# EAGLE design tes1 (EAGLE 6.2)
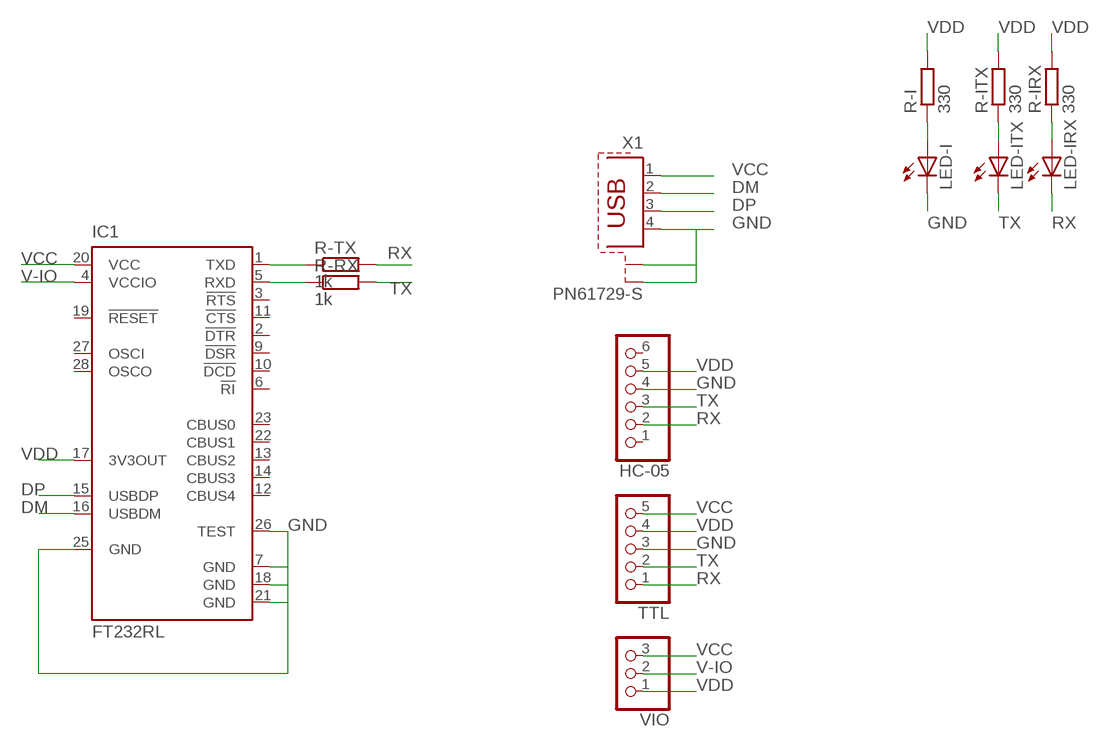
[diagram p0: schematic, sheet 1]

## Parts
HC-05  PINHD-1X6  [1X06]
IC1  FT232RL  [SSOP28]
LED-I  LED3MM  [LED3MM]
LED-IRX  LED3MM  [LED3MM]
LED-ITX  LED3MM  [LED3MM]
R-I  330  R-EU_0204/7  [0204/7]
R-IRX  330  R-EU_0204/7  [0204/7]
R-ITX  330  R-EU_0204/7  [0204/7]
R-RX  1k  R-EU_0204/7  [0204/7]
R-TX  1k  R-EU_0204/7  [0204/7]
TTL  PINHD-1X5  [1X05]
VIO  PINHD-1X3  [1X03]
X1  PN61729-S  [PN61729-S]

## Nets
DM: IC1.16(USBDM) X1.2
DP: IC1.15(USBDP) X1.3
GND: HC-05.4 IC1.7(GND) IC1.18(GND) IC1.21(GND) IC1.25(GND) IC1.26(TEST) LED-I.K(C) TTL.3 X1.4 X1.S1 X1.S2
N$1: LED-I.A R-I.1
N$2: LED-ITX.A R-ITX.1
N$4: LED-IRX.A R-IRX.1
N$10: IC1.5(RXD) R-RX.1
N$11: IC1.1(TXD) R-TX.1
RX: HC-05.2 LED-IRX.K(C) R-TX.2 TTL.1
TX: HC-05.3 LED-ITX.K(C) R-RX.2 TTL.2
V-IO: IC1.4(VCCIO) VIO.2
VCC: IC1.20(VCC) TTL.5 VIO.3 X1.1
VDD: HC-05.5 IC1.17(3V3OUT) R-I.2 R-IRX.2 R-ITX.2 TTL.4 VIO.1
Unconnected: HC-05.1 HC-05.6 IC1.2(!DTR) IC1.3(!RTS) IC1.6(!RI) IC1.9(!DSR) IC1.10(!DCD) IC1.11(!CTS) IC1.12(CBUS4) IC1.13(CBUS2) IC1.14(CBUS3) IC1.19(!RESET) IC1.22(CBUS1) IC1.23(CBUS0) IC1.27(OSCI) IC1.28(OSCO)

## Library data of the parts
HC-05 = pinhead:PINHD-1X6: PIN HEADER
IC1 = ftdichip:FT232R: Source: http://www.ftdichip.com/Documents/DataSheets/DS_FT232R_v104.pdf; MPN: FT232RL; OC_FARNELL: 1146032; OC_NEWARK: 91K9918
LED-I LED-IRX LED-ITX = led:LED: LED OSRAM: - CHIPLED LG R971, LG N971, LY N971, LG Q971, LY Q971, LO R971, LY R971 LH N974, LH R974 LS Q976, LO Q976, LY Q976 LO Q996 - Hyper CHIPLED LW Q18S LB Q993, LB Q99A, LB R99A - SideLED LS A670, LO A670, LY A670, LG A670, LP A670 LB A673, LV A673, LT A673, LW A673 LH A674 LY A675 LS A676, LA A676, LO A676, LY A676, LW A676 LS A679, LY A679, LG A679 - Hyper Micro SIDELED® LS Y876, LA Y876, LO Y876, LY Y876 LT Y87S - SmartLED LW L88C, LW L88S LB L89C, LB L89S, LG L890 LS L89K, LO L89K, LY L89K LS L896, LA L896, LO L896, LY L896 - TOPLED LS T670, LO T670, LY T670, LG T670, LP T670 LSG T670, LSP T670, LSY T670, LOP T670, LYG T670 LG T671, LOG T671, LSG T671 LB T673, LV T673, LT T673, LW T673 LH T674 LS T676, LA T676, LO T676, LY T676, LB T676, LH T676, LSB T676, LW T676 LB T67C, LV T67C, LT T67C, LS T67K, LO T67K, LY T67K, LW E67C LS E67B, LA E67B, LO E67B, LY E67B, LB E67C, LV E67C, LT E67C LW T67C LS T679, LY T679, LG T679 LS T770, LO T770, LY T770, LG T770, LP T770 LB T773, LV T773, LT T773, LW T773 LH T774 LS E675, LA E675, LY E675, LS T675 LS T776, LA T776, LO T776, LY T776, LB T776 LHGB T686 LT T68C, LB T68C - Hyper Mini TOPLED® LB M676 - Mini TOPLED Santana® LG M470 LS M47K, LO M47K, LY M47K Source: http://www.osram.convergy.de LUXEON: - LUMILED® LXK2-PW12-R00, LXK2-PW12-S00, LXK2-PW14-U00, LXK2-PW14-V00 LXK2-PM12-R00, LXK2-PM12-S00, LXK2-PM14-U00 LXK2-PE12-Q00, LXK2-PE12-R00, LXK2-PE12-S00, LXK2-PE14-T00, LXK2-PE14-U00 LXK2-PB12-K00, LXK2-PB12-L00, LXK2-PB12-M00, LXK2-PB14-N00, LXK2-PB14-P00, LXK2-PB14-Q00 LXK2-PR12-L00, LXK2-PR12-M00, LXK2-PR14-Q00, LXK2-PR14-R00 LXK2-PD12-Q00, LXK2-PD12-R00, LXK2-PD12-S00 LXK2-PH12-R00, LXK2-PH12-S00 LXK2-PL12-P00, LXK2-PL12-Q00, LXK2-PL12-R00 Source: www.luxeon.com KINGBRIGHT: KA-3528ASYC Source: www.kingbright.com
R-I R-IRX R-ITX R-RX R-TX = resistor:R-EU_: RESISTOR, European symbol
TTL = pinhead:PINHD-1X5: PIN HEADER
VIO = pinhead:PINHD-1X3: PIN HEADER
X1 = con-berg:PN61729-S: BERG USB connector; OC_FARNELL: unknown; OC_NEWARK: unknown

## Board
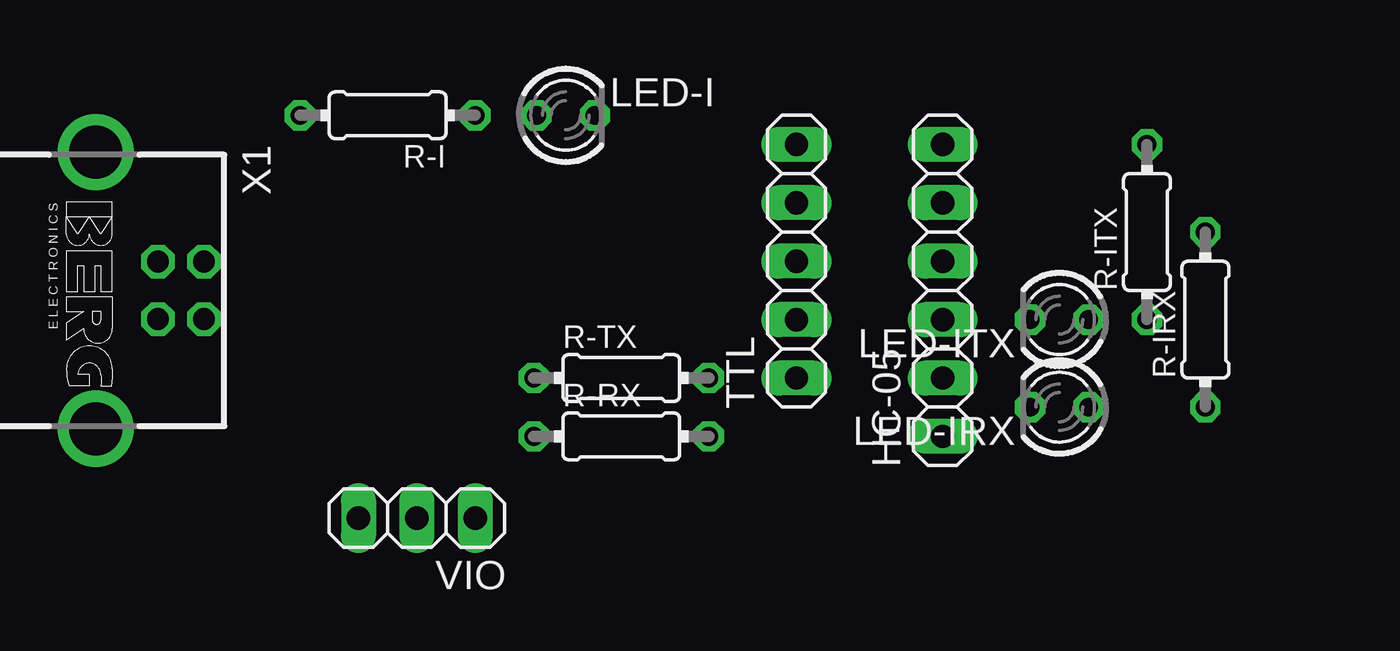
[diagram p1: board, top side]
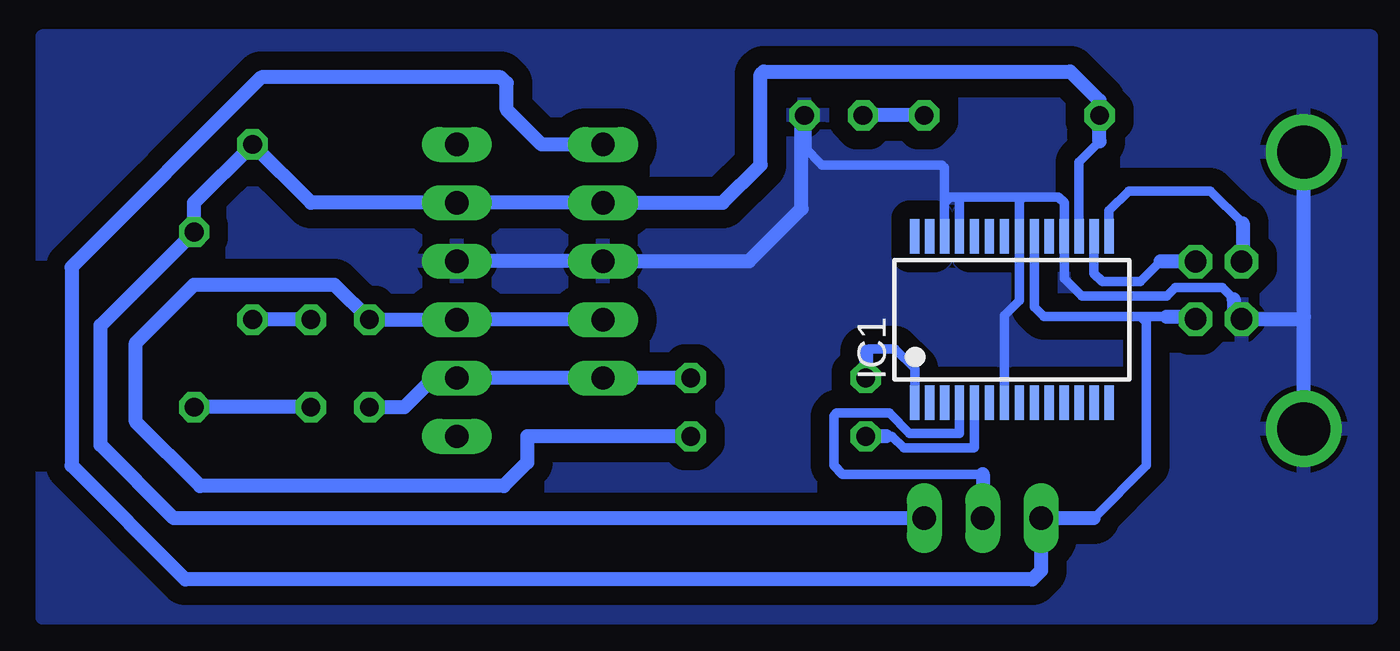
[diagram p2: board, bottom side, seen from below]

No outline drawn. Coordinates in mm, seen from the top.
Copper layers (1*16): Top 0.035mm / dielectric 1.5mm / Bottom 0.035mm
Design rules: minimum track width 10mil, minimum drill 24mil, track to track 8mil, track to pad 8mil, pad to pad 8mil, via to via 8mil, smd to smd 8mil, copper to edge 40mil, drill to drill 8mil, minimum pad ring 10mil, minimum via ring 8mil, stop-mask expansion 4mil, vias tented up to drill 0mil, thermal gap 10mil

### Footprints (pad centres in the part's own frame; a part is rotated, then mirrored left to right if it is on the bottom)
1X06 = drill 1.016 long: 1 -6.35,0; 2 -3.81,0; 3 -1.27,0; 4 1.27,0; 5 3.81,0; 6 6.35,0
SSOP28 = smd 0.4 x 1.5: 1 -4.225,-3.625; 2 -3.575,-3.625; 3 -2.925,-3.625; 4 -2.275,-3.625; 5 -1.625,-3.625; 6 -0.975,-3.625; 7 -0.325,-3.625; 8 0.325,-3.625; 9 0.975,-3.625; 10 1.625,-3.625; 11 2.275,-3.625; 12 2.925,-3.625; 13 3.575,-3.625; 14 4.225,-3.625; 15 4.225,3.625; 16 3.575,3.625; 17 2.925,3.625; 18 2.275,3.625; 19 1.625,3.625; 20 0.975,3.625; 21 0.325,3.625; 22 -0.325,3.625; 23 -0.975,3.625; 24 -1.625,3.625; 25 -2.275,3.625; 26 -2.925,3.625; 27 -3.575,3.625; 28 -4.225,3.625
LED3MM = drill 0.813 octagon: A -1.27,0; K 1.27,0
0204/7 = drill 0.813 octagon: 1 -3.81,0; 2 3.81,0
1X05 = drill 1.016 long: 1 -5.08,0; 2 -2.54,0; 3 0,0; 4 2.54,0; 5 5.08,0
1X03 = drill 1.016 long: 1 -2.54,0; 2 0,0; 3 2.54,0
PN61729-S = drill 0.95 octagon: 1 1.25,4.71; 2 -1.25,4.71; 3 -1.25,2.71; 4 1.25,2.71 | drill 2.3 pad 2.9: S1 -6.02,0; S2 6.02,0

### Placement (x,y rotation side)
HC-05  119.38,41.91 90 top
IC1  95.25,40.64 0 bottom
LED-I  103,49.53 0 top
LED-IRX  124.46,36.83 180 top
LED-ITX  124.46,40.64 180 top
R-I  95.25,49.53 180 top
R-IRX  130.81,40.64 90 top
R-ITX  128.27,44.45 90 top
R-RX  105.41,35.56 0 top
R-TX  105.41,38.1 0 top
TTL  113.03,43.18 90 top
VIO  96.52,32 180 top
X1  82.55,41.91 270 top

### Tracks (layer width: path | path; a pad name or v marks a point on that pad's centre or on a via)
DM
  Bottom 0.406: IC1.16 91.67,42.65 91.31,42.29 89.66,42.29 88.77,43.18
  Bottom 0.61: 88.77,43.18 87.28,43.18 X1.2
DP
  Bottom 0.406: IC1.15 91.03,45.37 90.17,46.23 86.61,46.23 85.22,44.83
  Bottom 0.61: 85.22,44.83 85.22,43.2 X1.3
GND
  Bottom 0.406: 94.74,45.97 93.22,45.97 92.97,45.73 IC1.18 92.97,42.43 92.2,41.66 88.52,41.66 88.14,42.04 86.11,42.04 85.6,41.53 | 94.74,45.97 97.54,45.97 | 97.54,45.97 97.92,45.97 98.17,45.72 | IC1.26 98.17,45.72 | IC1.25 97.53,45.96 97.54,45.97 | 94.74,45.97 94.92,45.79 IC1.21 94.92,41.47 95.58,40.82 IC1.7 | 98.17,45.72 98.17,47.25 98.3,47.37 103.5,47.37 104.27,48.13
  Bottom 0.61: 85.6,41.53 85.6,41 X1.4 82.66,40.66 82.55,40.77 | 104.27,48.13 LED-I.K 104.39,49.4 104.39,45.47 106.68,43.18 TTL.3 HC-05.4 | X1.S2 82.55,40.77 | 82.55,40.77 X1.S1
  pour Bottom (isolate 0.813): 79.63,52.96 137.41,52.96 137.41,28.7 137.41,27.69 79.63,27.69
N$1
  Bottom 0.61: R-I.1 LED-I.A
N$2
  Bottom 0.61: LED-ITX.A R-ITX.1
N$4
  Bottom 0.61: LED-IRX.A R-IRX.1
N$10
  Bottom 0.406: IC1.5 96.88,35.08 96.9,35.05 99.95,35.05 100.46,35.56 100.71,35.56
  Bottom 0.61: 100.71,35.56 R-RX.1
N$11
  Bottom 0.406: IC1.1 99.47,38.52 100.33,39.37 101.47,39.37 101.6,39.24
  Bottom 0.61: 101.6,39.24 R-TX.1
RX
  Bottom 0.61: R-TX.2 TTL.1 HC-05.2 120.4,38.1 121.67,36.83 LED-IRX.K
TX
  Bottom 0.61: TTL.2 HC-05.3 LED-ITX.K 124.71,42.16 130.81,42.16 133.35,39.62 133.35,36.2 130.56,33.4 117.35,33.4 116.33,34.42 116.33,35.56 R-RX.2
V-IO
  Bottom 0.406: IC1.4 97.53,35.7 97.54,35.69 99.69,35.69 100.58,36.58 102.87,36.58 103,36.45 103,34.29 102.62,33.91 96.52,33.91
  Bottom 0.61: 96.52,33.91 VIO.2
VCC
  Bottom 0.406: IC1.20 94.28,41.19 93.85,40.77 89.66,40.77 | 89.66,40.77 88.52,40.77 | 89.66,40.77 89.41,40.51 89.41,34.29 91.69,32
  Bottom 0.61: 88.52,40.77 87.37,40.77 X1.1 | 91.69,32 VIO.3 93.98,29.72 94.36,29.34 131.19,29.34 136.14,34.29 136.14,42.93 127.89,51.18 117.47,51.18 117.22,50.93 117.22,49.78 115.7,48.26 TTL.5
VDD
  Bottom 0.406: IC1.17 92.33,47.5 91.44,48.39
  Bottom 0.61: 91.44,48.39 R-I.2 91.44,50.16 92.71,51.44 106.05,51.44 106.17,51.31 106.17,47.37 107.82,45.72 TTL.4 HC-05.5 125.73,45.72 R-ITX.2 130.81,45.72 R-IRX.2 134.87,40.39 134.87,35.18 131.7,32 VIO.1